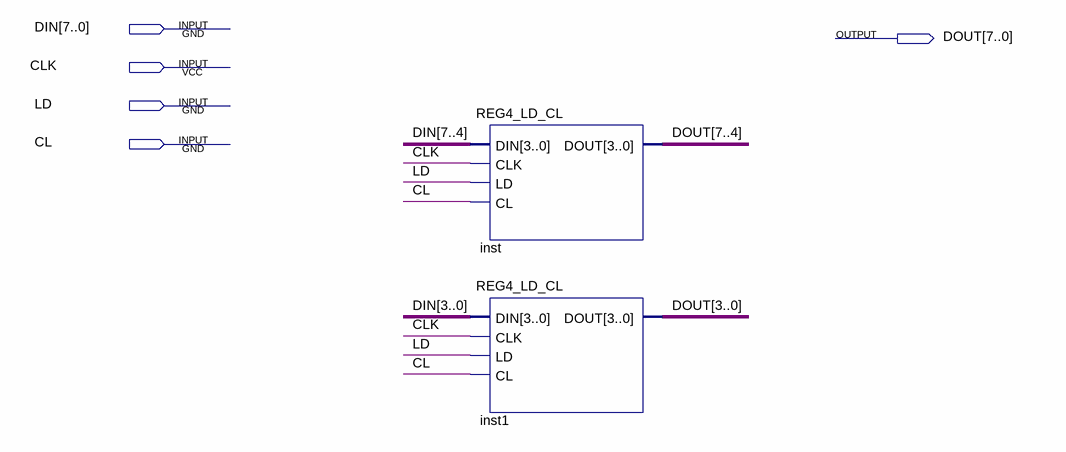
[diagram p0: schematic sheet]
// Quartus schematic REG8_LD_CL.bdf as structural Verilog: 2 symbols, 5 pins
module REG8_LD_CL (
  input  [7:0] DIN,
  input  CLK,
  input  LD,
  input  CL,
  output [7:0] DOUT
);

  REG4_LD_CL inst (.DIN(DIN[7:4]), .CLK(CLK), .LD(LD), .CL(CL), .DOUT(DOUT[7:4]));
  REG4_LD_CL inst1 (.DIN(DIN[3:0]), .CLK(CLK), .LD(LD), .CL(CL), .DOUT(DOUT[3:0]));
endmodule
